# Altium schematic sheet old_main.SchDoc
size A4
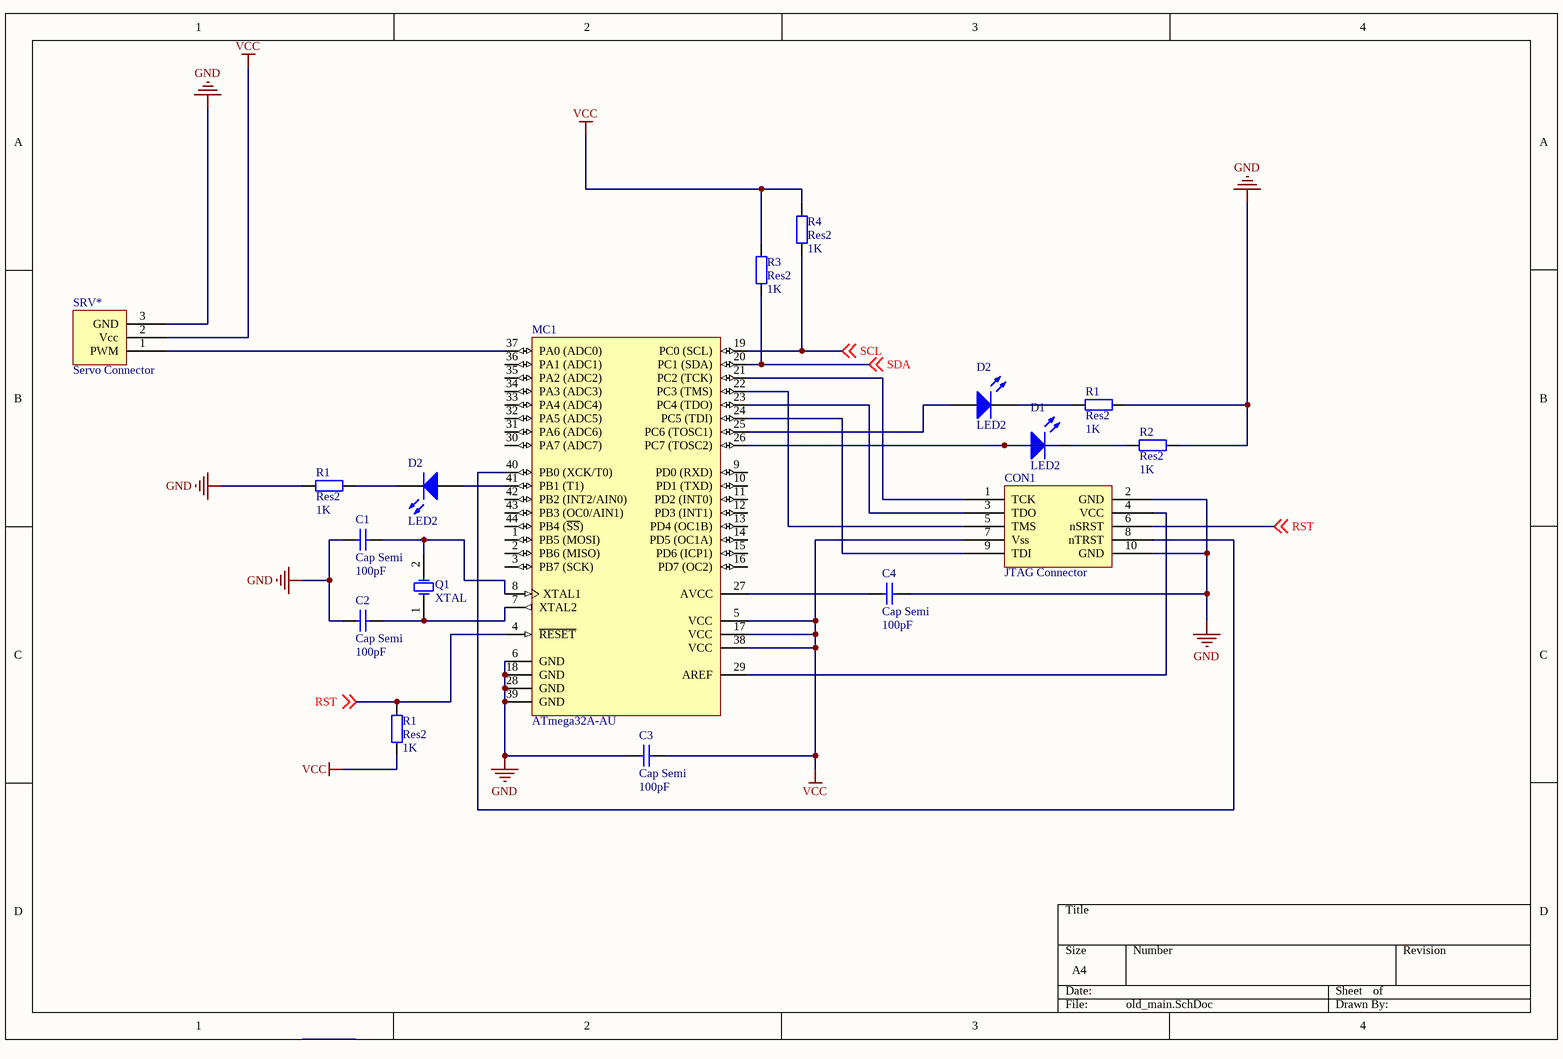
[diagram p0: old_main.SchDoc]

## Parts
(Parts that share a designator on the sheet are numbered #1, #2 ... from top to bottom, then left to right.)
C1  Cap Semi  value 100pF  [C1206]
C2  Cap Semi  value 100pF  [C1206]
C3  Cap Semi  value 100pF  [C1206]
C4  Cap Semi  value 100pF  [C1206]
CON1  JTAG Connector
D1  LED2  [3.2X1.6X1.1]
D2#1  LED2  [3.2X1.6X1.1]
D2#2  LED2  [3.2X1.6X1.1]
MC1  ATmega32A-AU  [44A_N]
Q1  XTAL  [R38]
R1#1  Res2  value 1K  [AXIAL-0.4]
R1#2  Res2  value 1K  [AXIAL-0.4]
R1#3  Res2  value 1K  [AXIAL-0.4]
R2  Res2  value 1K  [AXIAL-0.4]
R3  Res2  value 1K  [AXIAL-0.4]
R4  Res2  value 1K  [AXIAL-0.4]
SRV*  Servo Connector

## Nets
GND: C1.1 C2.1 C3.1 C4.2 CON1.2(GND) CON1.10(GND) MC1.6(GND) MC1.18(GND) MC1.28(GND) MC1.39(GND) R1#1.1 R1#2.1 R2.1 SRV*.3(GND)
VCC: C3.2 CON1.7(Vss) MC1.5(VCC) MC1.17(VCC) MC1.38(VCC) R1#3.1 R3.1 R4.1 SRV*.2(Vcc)
RST: CON1.6(nSRST) MC1.4(~{RESET}) R1#3.2 ; off-sheet RST
SCL: MC1.19(PC0_(SCL)) R4.2 ; off-sheet SCL
SDA: MC1.20(PC1_(SDA)) R3.2 ; off-sheet SDA
NetC1_2: C1.2 MC1.8(XTAL1) Q1.2(OSC2)
NetC2_2: C2.2 MC1.7(XTAL2) Q1.1(OSC1)
NetC4_1: C4.1 MC1.27(AVCC)
NetCON1_1: CON1.1(TCK) MC1.21(PC2_(TCK))
NetCON1_3: CON1.3(TDO) MC1.23(PC4_(TDO))
NetCON1_4: CON1.4(VCC) MC1.29(AREF)
NetCON1_5: CON1.5(TMS) MC1.22(PC3_(TMS))
NetCON1_8: CON1.8(nTRST) MC1.40(PB0_(XCK/T0))
NetCON1_9: CON1.9(TDI) MC1.24(PC5_(TDI))
NetD1_1: D1.1(A) MC1.26(PC7_(TOSC2))
NetD1_2: D1.2(K) R2.2
NetD2#1_1: D2#1.1(A) MC1.25(PC6_(TOSC1))
NetD2#1_2: D2#1.2(K) R1#1.2
NetD2#2_1: D2#2.1(A) MC1.41(PB1_(T1))
NetD2#2_2: D2#2.2(K) R1#2.2
NetMC1_37: MC1.37(PA0_(ADC0)) SRV*.1(PWM)

Not connected (* = marked no-connect by the designer): MC1 1(PB5_(MOSI)) 2(PB6_(MISO)) 3(PB7_(SCK)) 9(PD0_(RXD)) 10(PD1_(TXD)) 11(PD2_(INT0)) 12(PD3_(INT1)) 13(PD4_(OC1B)) 14(PD5_(OC1A)) 15(PD6_(ICP1)) 16(PD7_(OC2)) 30(PA7_(ADC7)) 31(PA6_(ADC6)) 32(PA5_(ADC5)) 33(PA4_(ADC4)) 34(PA3_(ADC3)) 35(PA2_(ADC2)) 36(PA1_(ADC1)) 42(PB2_(INT2/AIN0)) 43(PB3_(OC0/AIN1)) 44(PB4_(~{SS}))

## Library data of the parts
C1-C4 = Cap Semi: Capacitor (Semiconductor SIM Model); Published: 8-Jun-2000; LatestRevisionDate: 29-May-2009; LatestRevisionNote: IPC-7351 Footprint Added.; PackageReference: C1206; Publisher: Altium Limited; PackageDescription: Chip Capacitor
D1 D2#1 D2#2 = LED2: Typical RED, GREEN, YELLOW, AMBER GaAs LED; Published: 8-Jun-2000; LatestRevisionDate: 17-Jul-2002; LatestRevisionNote: Re-released for DXP Platform.; PackageVersion: Feb-2002; PackageReference: 3.2X1.6X1.1; Publisher: Altium Limited; PackageDescription: SM LED; 2 Flat Leads
MC1 = ATmega32A-AU: 8-bit AVR Microcontroller, 2.7-5.5V, 16MHz, 32KB Flash, 1KB EEPROM, 2KB SRAM, 44-pin TQFP, Industrial Grade (-40°C to 85°C); DatasheetVersion: revC, Feb-2011; PackageVersion: revC, Oct-2010; PackageReference: 44A; PackageDescription: 44-Pin Plastic Thin Profile Quad Flat Pack, 10 x 10 x 1.0 mm Body, 0.8 mm Pitch (TQFP); Code_JEDEC: MS-026-ACB; ComponentLink1Description: Manufacturer URL; ComponentLink1URL: http://www.atmel.com/; ComponentLink2Description: ATmega32A Datasheet; ComponentLink2URL: http://www.atmel.com/dyn/resources/prod_documents/doc8155.pdf; ComponentLink3Description: ATmega32A Summary; ComponentLink3URL: http://www.atmel.com/dyn/resources/prod_documents/8155S.pdf
Q1 = XTAL: Crystal Oscillator; Published: 8-Jun-2000; LatestRevisionDate: 17-Jul-2002; LatestRevisionNote: Re-released for DXP Platform.; PackageReference: R38; Publisher: Altium Limited; PackageDescription: Crystal, Thru-Hole; 2 Leads; Body 3.1 x 8.2 mm (Dia.xH)
R1#1-R1#3 R2-R4 = Res2: Resistor; Published: 8-Jun-2000; LatestRevisionDate: 17-Jul-2002; LatestRevisionNote: Re-released for DXP Platform.; PackageReference: AXIAL-0.4; Publisher: Altium Limited; PackageDescription: Axial Device, Thru-Hole; 2 Leads; 0.4 in Pin Spacing